# Altium schematic sheet data_right.SchDoc
size 241 x 584 mm; SheetNumber: 2; SheetTotal: 3
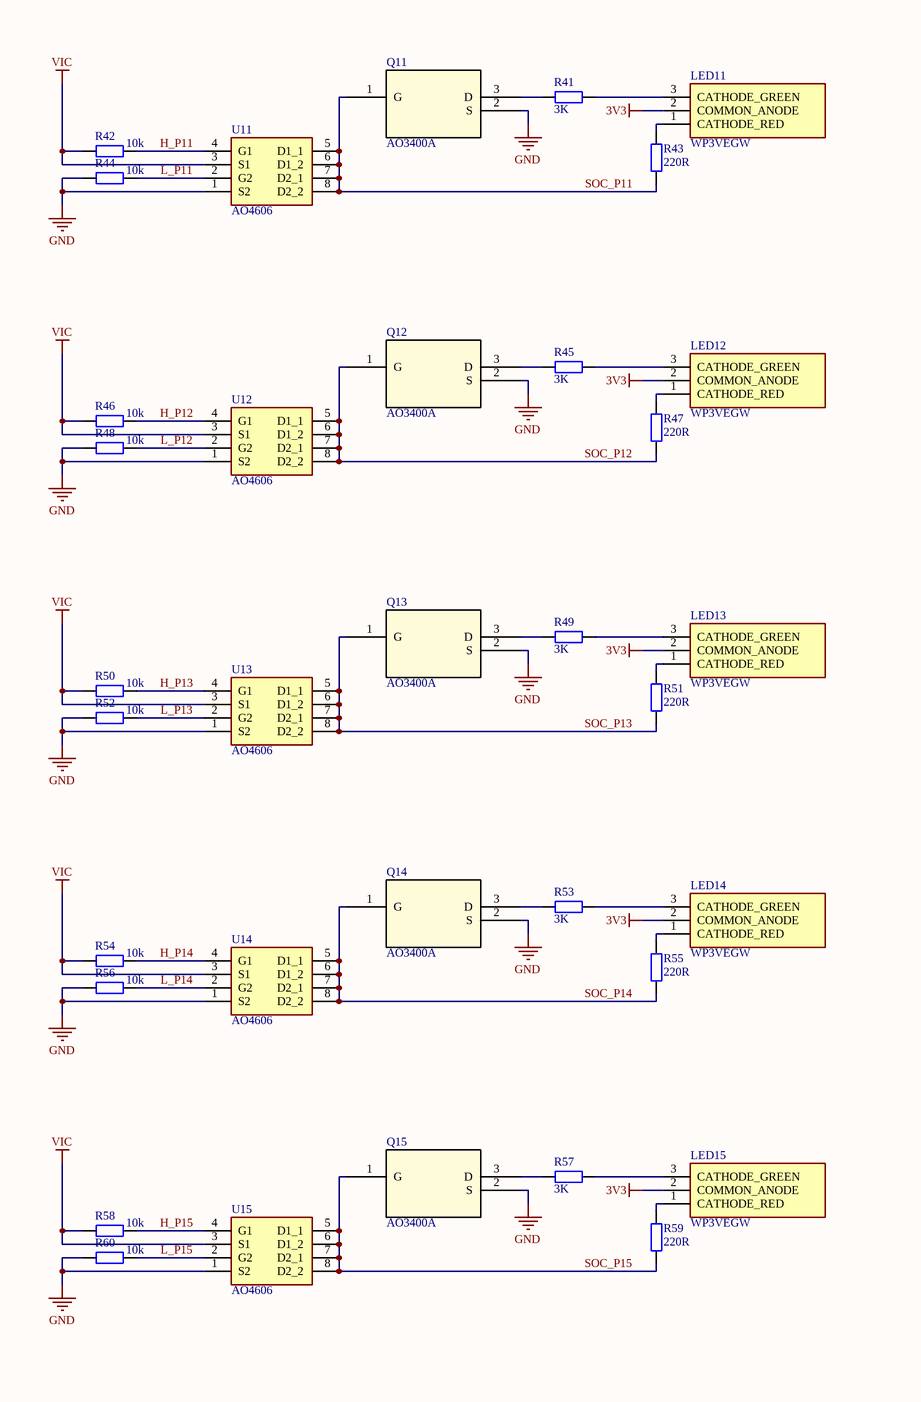
[diagram p0: data_right.SchDoc, top]
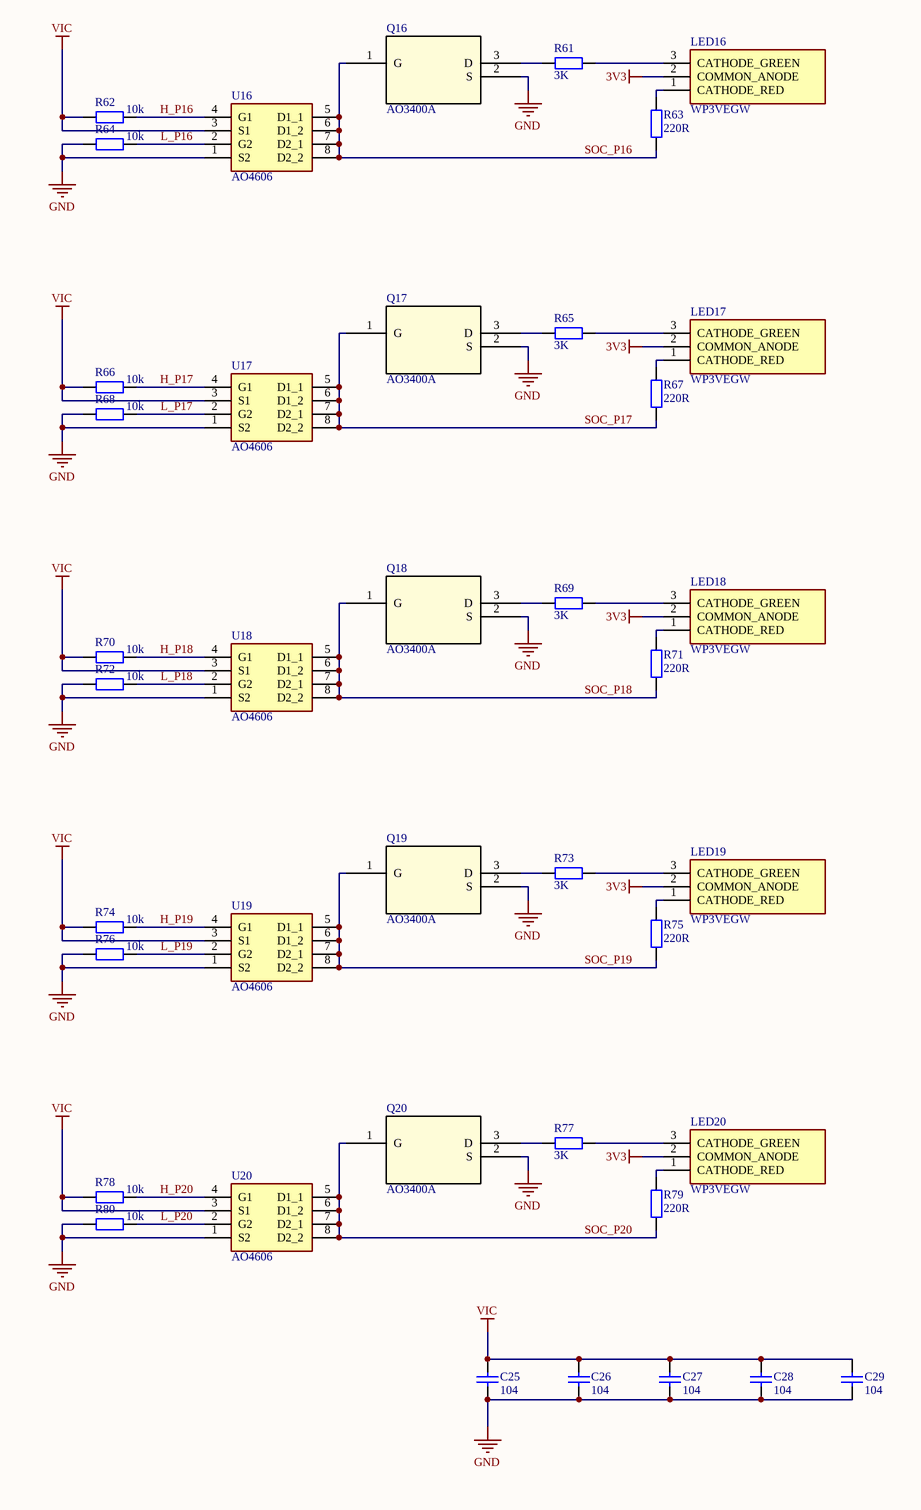
[diagram p1: data_right.SchDoc, bottom]

## Parts
C25  104  [tu 0805]
C26  104  [tu 0805]
C27  104  [tu 0805]
C28  104  [tu 0805]
C29  104  [tu 0805]
LED11  WP3VEGW  [WP3VEGW]
LED12  WP3VEGW  [WP3VEGW]
LED13  WP3VEGW  [WP3VEGW]
LED14  WP3VEGW  [WP3VEGW]
LED15  WP3VEGW  [WP3VEGW]
LED16  WP3VEGW  [WP3VEGW]
LED17  WP3VEGW  [WP3VEGW]
LED18  WP3VEGW  [WP3VEGW]
LED19  WP3VEGW  [WP3VEGW]
LED20  WP3VEGW  [WP3VEGW]
Q11  AO3400A  [SOT-23-3L_AOS]
Q12  AO3400A  [SOT-23-3L_AOS]
Q13  AO3400A  [SOT-23-3L_AOS]
Q14  AO3400A  [SOT-23-3L_AOS]
Q15  AO3400A  [SOT-23-3L_AOS]
Q16  AO3400A  [SOT-23-3L_AOS]
Q17  AO3400A  [SOT-23-3L_AOS]
Q18  AO3400A  [SOT-23-3L_AOS]
Q19  AO3400A  [SOT-23-3L_AOS]
Q20  AO3400A  [SOT-23-3L_AOS]
R41  3K  [tro smd 0805]
R42  10k  [tro smd 0805]
R43  220R  [tro smd 0805]
R44  10k  [tro smd 0805]
R45  3K  [tro smd 0805]
R46  10k  [tro smd 0805]
R47  220R  [tro smd 0805]
R48  10k  [tro smd 0805]
R49  3K  [tro smd 0805]
R50  10k  [tro smd 0805]
R51  220R  [tro smd 0805]
R52  10k  [tro smd 0805]
R53  3K  [tro smd 0805]
R54  10k  [tro smd 0805]
R55  220R  [tro smd 0805]
R56  10k  [tro smd 0805]
R57  3K  [tro smd 0805]
R58  10k  [tro smd 0805]
R59  220R  [tro smd 0805]
R60  10k  [tro smd 0805]
R61  3K  [tro smd 0805]
R62  10k  [tro smd 0805]
R63  220R  [tro smd 0805]
R64  10k  [tro smd 0805]
R65  3K  [tro smd 0805]
R66  10k  [tro smd 0805]
R67  220R  [tro smd 0805]
R68  10k  [tro smd 0805]
R69  3K  [tro smd 0805]
R70  10k  [tro smd 0805]
R71  220R  [tro smd 0805]
R72  10k  [tro smd 0805]
R73  3K  [tro smd 0805]
R74  10k  [tro smd 0805]
R75  220R  [tro smd 0805]
R76  10k  [tro smd 0805]
R77  3K  [tro smd 0805]
R78  10k  [tro smd 0805]
R79  220R  [tro smd 0805]
R80  10k  [tro smd 0805]
U11  AO4606  [SOIC127P600X175-8N]
U12  AO4606  [SOIC127P600X175-8N]
U13  AO4606  [SOIC127P600X175-8N]
U14  AO4606  [SOIC127P600X175-8N]
U15  AO4606  [SOIC127P600X175-8N]
U16  AO4606  [SOIC127P600X175-8N]
U17  AO4606  [SOIC127P600X175-8N]
U18  AO4606  [SOIC127P600X175-8N]
U19  AO4606  [SOIC127P600X175-8N]
U20  AO4606  [SOIC127P600X175-8N]

## Nets
3V3: LED11.2(COMMON_ANODE) LED12.2(COMMON_ANODE) LED13.2(COMMON_ANODE) LED14.2(COMMON_ANODE) LED15.2(COMMON_ANODE) LED16.2(COMMON_ANODE) LED17.2(COMMON_ANODE) LED18.2(COMMON_ANODE) LED19.2(COMMON_ANODE) LED20.2(COMMON_ANODE)
GND: C25.2 C26.2 C27.2 C28.2 C29.2 Q11.2(S) Q12.2(S) Q13.2(S) Q14.2(S) Q15.2(S) Q16.2(S) Q17.2(S) Q18.2(S) Q19.2(S) Q20.2(S) R44.1 R48.1 R52.1 R56.1 R60.1 R64.1 R68.1 R72.1 R76.1 R80.1 U11.1(S2) U12.1(S2) U13.1(S2) U14.1(S2) U15.1(S2) U16.1(S2) U17.1(S2) U18.1(S2) U19.1(S2) U20.1(S2)
VIC: C25.1 C26.1 C27.1 C28.1 C29.1 R42.1 R46.1 R50.1 R54.1 R58.1 R62.1 R66.1 R70.1 R74.1 R78.1 U11.3(S1) U12.3(S1) U13.3(S1) U14.3(S1) U15.3(S1) U16.3(S1) U17.3(S1) U18.3(S1) U19.3(S1) U20.3(S1)
H_P11: R42.2 U11.4(G1)
H_P12: R46.2 U12.4(G1)
H_P13: R50.2 U13.4(G1)
H_P14: R54.2 U14.4(G1)
H_P15: R58.2 U15.4(G1)
H_P16: R62.2 U16.4(G1)
H_P17: R66.2 U17.4(G1)
H_P18: R70.2 U18.4(G1)
H_P19: R74.2 U19.4(G1)
H_P20: R78.2 U20.4(G1)
L_P11: R44.2 U11.2(G2)
L_P12: R48.2 U12.2(G2)
L_P13: R52.2 U13.2(G2)
L_P14: R56.2 U14.2(G2)
L_P15: R60.2 U15.2(G2)
L_P16: R64.2 U16.2(G2)
L_P17: R68.2 U17.2(G2)
L_P18: R72.2 U18.2(G2)
L_P19: R76.2 U19.2(G2)
L_P20: R80.2 U20.2(G2)
SOC_P11: Q11.1(G) R43.1 U11.5(D1_1) U11.6(D1_2) U11.7(D2_1) U11.8(D2_2)
SOC_P12: Q12.1(G) R47.1 U12.5(D1_1) U12.6(D1_2) U12.7(D2_1) U12.8(D2_2)
SOC_P13: Q13.1(G) R51.1 U13.5(D1_1) U13.6(D1_2) U13.7(D2_1) U13.8(D2_2)
SOC_P14: Q14.1(G) R55.1 U14.5(D1_1) U14.6(D1_2) U14.7(D2_1) U14.8(D2_2)
SOC_P15: Q15.1(G) R59.1 U15.5(D1_1) U15.6(D1_2) U15.7(D2_1) U15.8(D2_2)
SOC_P16: Q16.1(G) R63.1 U16.5(D1_1) U16.6(D1_2) U16.7(D2_1) U16.8(D2_2)
SOC_P17: Q17.1(G) R67.1 U17.5(D1_1) U17.6(D1_2) U17.7(D2_1) U17.8(D2_2)
SOC_P18: Q18.1(G) R71.1 U18.5(D1_1) U18.6(D1_2) U18.7(D2_1) U18.8(D2_2)
SOC_P19: Q19.1(G) R75.1 U19.5(D1_1) U19.6(D1_2) U19.7(D2_1) U19.8(D2_2)
SOC_P20: Q20.1(G) R79.1 U20.5(D1_1) U20.6(D1_2) U20.7(D2_1) U20.8(D2_2)
NetLED11_1: LED11.1(CATHODE_RED) R43.2
NetLED11_3: LED11.3(CATHODE_GREEN) R41.1
NetLED12_1: LED12.1(CATHODE_RED) R47.2
NetLED12_3: LED12.3(CATHODE_GREEN) R45.1
NetLED13_1: LED13.1(CATHODE_RED) R51.2
NetLED13_3: LED13.3(CATHODE_GREEN) R49.1
NetLED14_1: LED14.1(CATHODE_RED) R55.2
NetLED14_3: LED14.3(CATHODE_GREEN) R53.1
NetLED15_1: LED15.1(CATHODE_RED) R59.2
NetLED15_3: LED15.3(CATHODE_GREEN) R57.1
NetLED16_1: LED16.1(CATHODE_RED) R63.2
NetLED16_3: LED16.3(CATHODE_GREEN) R61.1
NetLED17_1: LED17.1(CATHODE_RED) R67.2
NetLED17_3: LED17.3(CATHODE_GREEN) R65.1
NetLED18_1: LED18.1(CATHODE_RED) R71.2
NetLED18_3: LED18.3(CATHODE_GREEN) R69.1
NetLED19_1: LED19.1(CATHODE_RED) R75.2
NetLED19_3: LED19.3(CATHODE_GREEN) R73.1
NetLED20_1: LED20.1(CATHODE_RED) R79.2
NetLED20_3: LED20.3(CATHODE_GREEN) R77.1
NetQ11_3: Q11.3(D) R41.2
NetQ12_3: Q12.3(D) R45.2
NetQ13_3: Q13.3(D) R49.2
NetQ14_3: Q14.3(D) R53.2
NetQ15_3: Q15.3(D) R57.2
NetQ16_3: Q16.3(D) R61.2
NetQ17_3: Q17.3(D) R65.2
NetQ18_3: Q18.3(D) R69.2
NetQ19_3: Q19.3(D) R73.2
NetQ20_3: Q20.3(D) R77.2

## Library data of the parts
C25-C29 = Tu 0805 106 16V 10%: Dán; Ten_Linh_Kien: Tụ 0805 106-10uF 10% 16V; So_Chan: 2; Don_Vi: Con; Ma_Hang: MH004553; Chung_Loai: Dán; Kieu_Chan: *
LED11-LED20 = WP3VEGW: LED RED/GREEN 3mm; Manufacturer_Name: Kingbright; Datasheet Link: https://www.mouser.com/datasheet/2/216/WP3VEGW-47873.pdf; Height: 6.93mm; Manufacturer_Part_Number: WP3VEGW; Mouser Part Number: 604-WP3VEGW; Mouser Price/Stock: https://www.mouser.co.uk/ProductDetail/Kingbright/WP3VEGW?qs=58z0TXQGVSS6OtgxGPtI4A%3D%3D; Arrow Part Number: WP3VEGW; Arrow Price/Stock: https://www.arrow.com/en/products/wp3vegw/kingbright?region=nac
Q11-Q20 = AO3400A: N-MOSFET; Mfr_Name: Alpha and Omega Semiconductor; Type: DEV; Copyright: Copyright (C) 2023 Ultra Librarian. All rights reserved.; Manufacturer_Part_Number: AO3400A; RefDes: RefDes
R41-R80 = Tro 0805 1% 10k: Dán; Don_Vi: Con; So_Chan: 2; Ten_Linh_Kien: Trở 0805 1% 10k; Ma_Hang: MH005473; Chung_Loai: Dán; Kieu_Chan: *
U11-U20 = AO4606: SMALL SIGNAL FIELD-EFFECT TRANSISTOR, 6A I(D), 30V, 2-ELEMENT, N-CHANNEL AND P-CHANNEL, SILICON, METAL-OXIDE SEMICONDUCTOR FET; Manufacturer_Name: Alpha & Omega Semiconductors; Geometry.Height: 1.75mm; Manufacturer_Part_Number: AO4606; Mouser Part Number: *; Mouser Price/Stock: *; Arrow Part Number: AO4606; Arrow Price/Stock: https://www.arrow.com/en/products/ao4606/alpha-and-omega-semiconductor?region=nac; Datasheet Link: https://datasheet.datasheetarchive.com/originals/distributors/Datasheets-AOS/DSAAOS100079.pdf